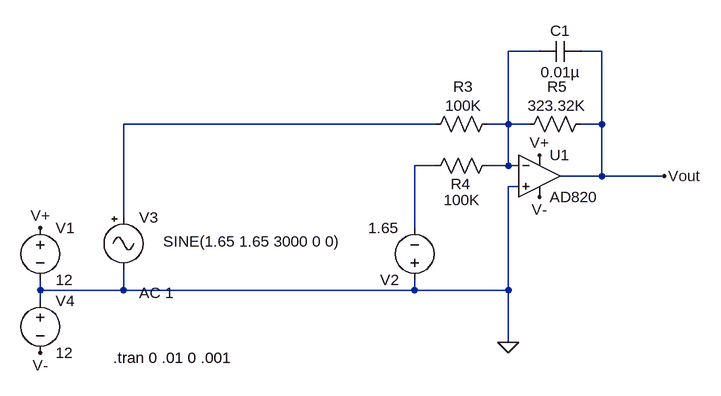
[diagram p0: schematic spank_output.asc]
spank_output.asc, the LTspice schematic file:
Version 4
SHEET 1 888 792
WIRE 624 256 576 256
WIRE 720 256 688 256
WIRE 464 368 -16 368
WIRE 576 368 576 256
WIRE 576 368 544 368
WIRE 608 368 576 368
WIRE 720 368 720 256
WIRE 720 368 688 368
WIRE 464 432 432 432
WIRE 576 432 576 368
WIRE 576 432 544 432
WIRE 592 432 576 432
WIRE 720 448 720 368
WIRE 720 448 656 448
WIRE 816 448 720 448
WIRE 592 464 576 464
WIRE -16 512 -16 368
WIRE 432 528 432 432
WIRE -144 624 -144 608
WIRE -16 624 -16 592
WIRE -16 624 -144 624
WIRE 432 624 432 608
WIRE 432 624 -16 624
WIRE 576 624 576 464
WIRE 576 624 432 624
WIRE -144 640 -144 624
WIRE 576 704 576 624
FLAG 576 704 0
FLAG -144 528 V+
FLAG -144 720 V-
FLAG 624 480 V-
FLAG 624 416 V+
FLAG 816 448 Vout
SYMBOL Misc\\signal -16 496 R0
WINDOW 123 24 132 Left 2
WINDOW 39 0 0 Left 0
WINDOW 3 61 53 Left 2
SYMATTR Value2 AC 1
SYMATTR Value SINE(1.65 1.65 3000 0 0)
SYMATTR InstName V3
SYMBOL voltage 432 624 R180
WINDOW 123 0 0 Left 0
WINDOW 39 0 0 Left 0
SYMATTR InstName V2
SYMATTR Value 1.65
SYMBOL res 560 416 R90
WINDOW 0 60 57 VBottom 2
WINDOW 3 53 55 VTop 2
SYMATTR InstName R4
SYMATTR Value 100K
SYMBOL voltage -144 512 R0
WINDOW 123 0 0 Left 0
WINDOW 39 0 0 Left 0
SYMATTR InstName V1
SYMATTR Value 12
SYMBOL voltage -144 624 R0
WINDOW 123 0 0 Left 0
WINDOW 39 0 0 Left 0
SYMATTR InstName V4
SYMATTR Value 12
SYMBOL Opamps\\AD820 624 384 R0
SYMATTR InstName U1
SYMBOL res 560 352 R90
WINDOW 0 -26 53 VBottom 2
WINDOW 3 -28 53 VTop 2
SYMATTR InstName R3
SYMATTR Value 100K
SYMBOL res 704 352 R90
WINDOW 0 -26 53 VBottom 2
WINDOW 3 -28 53 VTop 2
SYMATTR InstName R5
SYMATTR Value 323.32K
SYMBOL cap 688 240 R90
WINDOW 0 0 32 VBottom 2
WINDOW 3 32 32 VTop 2
SYMATTR InstName C1
SYMATTR Value 0.01µ
SYMATTR SpiceLine V=200 Irms=0 Rser=0 Lser=0 mfg="Murata" pn="GRM31CR72D104KW03" type="X7R"
TEXT -32 728 Left 2 !.tran 0 .01 0 .001

The netlist it stands for:
* spank_output.asc
V3 N002 0 SINE(1.65 1.65 3000 0 0) AC 1
V2 0 N003 1.65
R4 N001 N003 100K
V1 V+ 0 12
V4 0 V- 12
XU1 0 N001 V+ V- Vout AD820  ; pins In+ In- V+ V- OUT
R3 N001 N002 100K
R5 Vout N001 323.32K
C1 Vout N001 0.01µ V=200 Irms=0 Rser=0 Lser=0 mfg="Murata" pn="GRM31CR72D104KW03" type="X7R"
.tran 0 .01 0 .001
.backanno
.end